# EAGLE design Vibrationdriver_WS2811 (EAGLE 7.1.0)
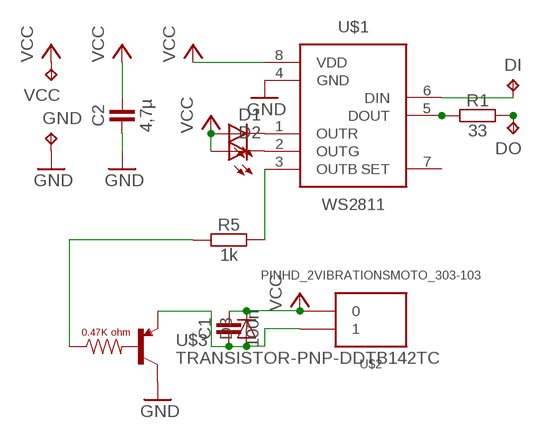
[diagram p0: schematic, sheet 1]

## Parts
C1  100n  CAPACITOR-0603  [C0603]
C2  4,7µ  CAPACITOR-0603  [C0603]
D1  LED-0603  [C0603]
D2  LED-0603  [C0603]
D3  DIODE-SOD110  [SOD110]
DI  TPTP08SQ  [TP08SQ]
DO  TPTP08SQ  [TP08SQ]
GND  TPTP08SQ  [TP08SQ]
R1  33  RESISTOR-0603  [C0603]
R5  1k  RESISTOR-0603  [C0603]
U$1  WS2811  [SOP-8]
U$2  PINHD_2VIBRATIONSMOTO_303-103  [VIBRATIONSMOTOR303-103]
U$3  TRANSISTOR-PNP-DDTB142TC  [SOT23-3]
VCC  TPTP08SQ  [TP08SQ]

## Nets
DIN: DI.TP U$1.6(DIN)
GND: C2.1 GND.TP U$1.4(GND) U$3.3(C)
N$2: R1.1 U$1.5(DOUT)
N$3: DO.TP R1.2
N$4: C1.1 D3.A U$2.2 U$3.2(E)
N$7: D1.C U$1.1(OUTR)
N$8: D2.C U$1.2(OUTG)
N$10: R5.1 U$3.1(B)
N$11: R5.2 U$1.3(OUTB)
VCC: C1.2 C2.2 D1.A D2.A D3.C U$1.8(VDD) U$2.1 VCC.TP
Unconnected: U$1.7(SET)

## Library data of the parts
C1 C2 = we-rcl:CAPACITOR: Capacitors ...4.7uF @ 6.3V -> 0402 ...10uF @ 16V -> 0603 ...22uF @ 25V -> 0805
D1 D2 = we-opto:LED: LEDs
D3 = we-rcl:DIODE: Diodes
DI DO GND VCC = testpad:TP: Test pad
R1 R5 = we-rcl:RESISTOR: Resistors all kinds in 0603 and 0402
U$1 = thar:WS2811
U$2 = thar:PINHD_2
U$3 = SparkFun-DiscreteSemi:TRANSISTOR-PNP-DDTB142TC

## Board
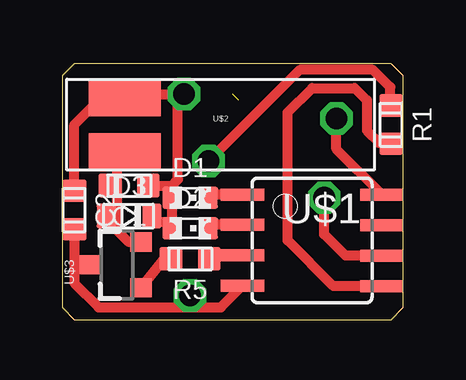
[diagram p1: board, top side]
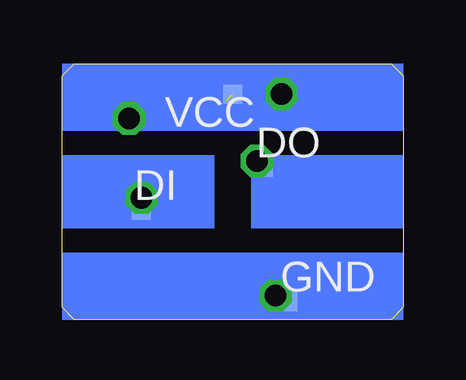
[diagram p2: board, bottom side, seen from below]

Size 14.22 x 10.67 mm. Coordinates in mm from the lower left corner, seen from the top.
Outline: 13.72,0 14.22,0.51 14.22,10.16 13.72,10.67 0.51,10.67 0,10.16 0,0.51 0.51,0 13.72,0
Copper layers (1*16): Top 0.035mm / dielectric 1.5mm / Bottom 0.035mm
Design rules "default": minimum track width 10mil, minimum drill 24mil, track to track 8mil, track to pad 8mil, pad to pad 8mil, via to via 8mil, smd to smd 8mil, copper to edge 40mil, drill to drill 8mil, minimum pad ring 10mil, minimum via ring 8mil, stop-mask expansion 4mil, vias tented up to drill 0mil, thermal gap 10mil

### Footprints (pad centres in the part's own frame; a part is rotated, then mirrored left to right if it is on the bottom)
C0603 = smd 1 x 0.95: 1 0,0.8; 2 0,-0.8
C0603' = smd 0.9 x 0.8: A 0,-0.75; C 0,0.75
SOD110 = smd 1 x 0.8: A 0,-0.95; C 0,0.95
TP08SQ = smd 0.8 x 0.8: TP 0,0
SOP-8 = smd 1.8 x 0.5: 1 -2.9,1.905; 2 -2.9,0.645; 3 -2.9,-0.625; 4 -2.9,-1.895; 5 2.9,-1.905; 6 2.9,-0.635; 7 2.9,0.635; 8 2.9,1.905
VIBRATIONSMOTOR303-103 = smd 3 x 1.5: 1 -4,1.1; 2 -4,-1.1
SOT23-3 = smd 0.8 x 0.9: 1 -0.95,-1; 2 0.95,-1; 3 0,1.1

### Placement (x,y rotation side)
C1  2.79,5.59 90 top
C2  0.51,4.57 180 top
D1  [C0603']  5.33,5.08 270 top
D2  [C0603']  5.33,3.81 270 top
D3  2.79,4.32 270 top
DI  10.92,4.57 0 bottom
DO  5.84,6.35 0 bottom
GND  4.83,0.76 0 bottom
R1  13.72,8.13 180 top
R5  5.33,2.54 90 top
U$1  10.41,3.3 0 top
U$2  6.6,8.13 0 top
U$3  2.29,2.29 90 top
VCC  7.11,9.4 0 bottom

### Tracks (layer width: path | path; a pad name or v marks a point on that pad's centre or on a via)
DIN  (via drill 0.9)
  Top 0.406: v10.92,5.08 10.92,3.56 11.81,2.67 U$1.6
GND  (via drill 0.9)
  Top 0.406: 0.51,2.29 0.51,2.2 | 0.51,2.2 U$3.3 0.51,2.29 | 0.51,2.2 0.51,1.52 1.52,0.51 5.33,0.51 | 5.33,0.51 v5.33,1.02 | C2.1 0.51,2.29 | 5.33,0.51 6.61,0.51 U$1.4
  Bottom 0.406: GND.TP 5.08,0.76 v5.33,1.02
N$2
  Top 0.406: 13.72,1.4 U$1.5 11.3,1.4 9.4,3.3 9.4,8.64 10.41,9.65 12.19,9.65 12.7,9.14 12.7,7.87 13.21,7.37 13.68,7.37 R1.1
N$3  (via drill 0.9)
  Top 0.406: v6.1,6.6 9.91,10.41 12.95,10.41 13.68,9.69 13.68,8.93 R1.2
  Bottom 0.406: DO.TP 6.1,6.35 v6.1,6.6
N$4
  Top 0.406: U$2.2 2.71,7.03 2.29,6.6 2.29,5.59 | 2.29,5.59 2.29,4.32 | 2.29,4.32 2.29,3.73 2.78,3.24 U$3.2 | D3.A 2.29,4.32 | C1.1 2.29,5.59
N$7
  Top 0.406: U$1.1 6.08,5.21 D1.C
N$8
  Top 0.406: U$1.2 6.08,3.95 D2.C
N$10
  Top 0.406: R5.1 4.28,2.58 U$3.1
N$11
  Top 0.406: U$1.3 6.02,2.68 R5.2
VCC  (via drill 0.9)  (1 unrouted)
  Top 0.406: 4.58,4.05 D1.A | 13.24,5.28 U$1.8 13.31,5.23 11.43,7.11 v11.43,8.38 | D2.A 4.58,4.05 | 4.58,4.05 4.57,4.06 4,4.06 D3.C | D1.A 4.58,5.32 4.57,5.33 | 4.57,5.33 4.57,5.07 D1.A | v5.08,9.4 3.81,9.4 3.22,9.23 U$2.1 2.43,9.4 1.78,9.4 0.51,8.13 C2.2 | v5.08,9.4 4.83,9.4 | C1.2 4.58,5.59 D1.A | 4.57,5.33 4.57,5.59 4.83,5.84 4.83,9.14 v5.08,9.4
  Bottom 0.406: v11.43,8.38 7.37,9.14 v5.08,9.4
(copper drawn outside any net)
  shapes: Bottom area x4